# EAGLE schematic NAND (EAGLE 7.2.0)
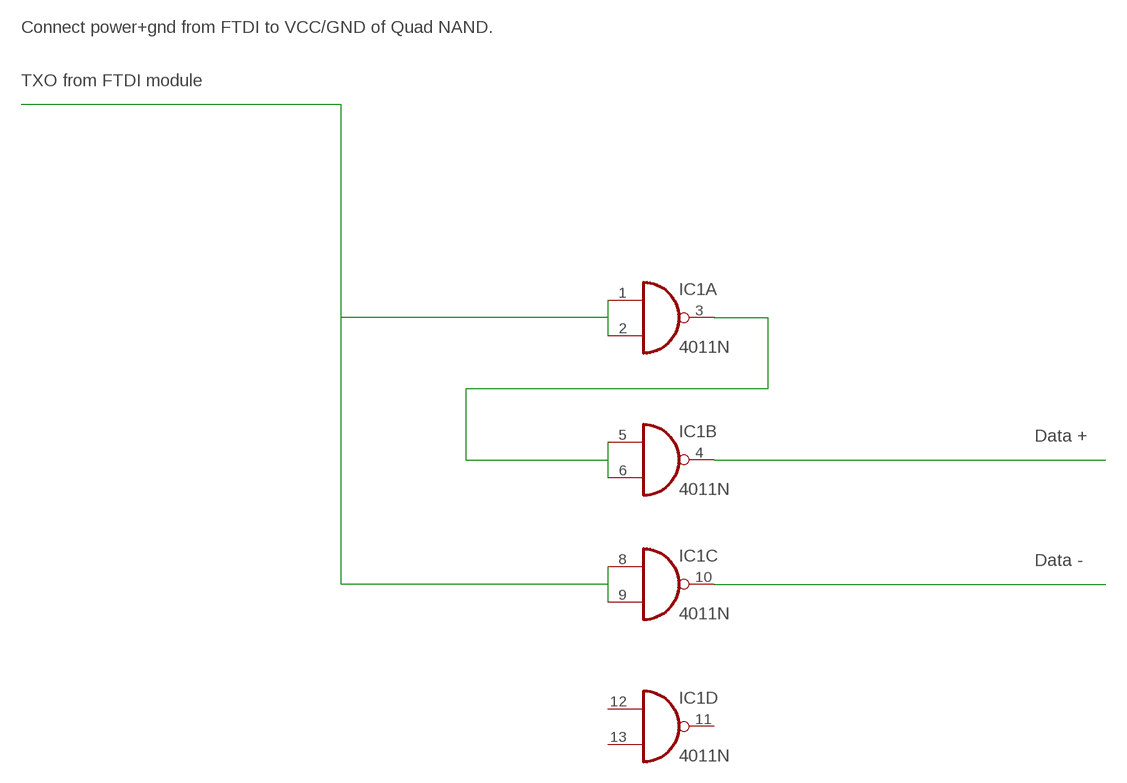
[diagram p0: schematic, sheet 1]

## Parts
IC1  4011N  [DIL14]

## Nets
N$2: IC1.3(A:O) IC1.5(B:I0) IC1.6(B:I1)
N$3: IC1.1(A:I0) IC1.2(A:I1) IC1.8(C:I0) IC1.9(C:I1)
N$5: IC1.10(C:O)
N$6: IC1.4(B:O)
Unconnected: IC1.11(D:O) IC1.12(D:I0) IC1.13(D:I1)

## Notes on the sheet
- Connect power+gnd from FTDI to VCC/GND of Quad NAND.
- TXO from FTDI module
- Data +
- Data -

## Power pins joined to a net without a drawn wire
VDD: IC1.14(P:VDD)
VSS: IC1.7(P:VSS)

## Library data of the parts
IC1 = 40xx:4011: Quad 2-input NAND